# EAGLE schematic hbridge (EAGLE 7.5.0)
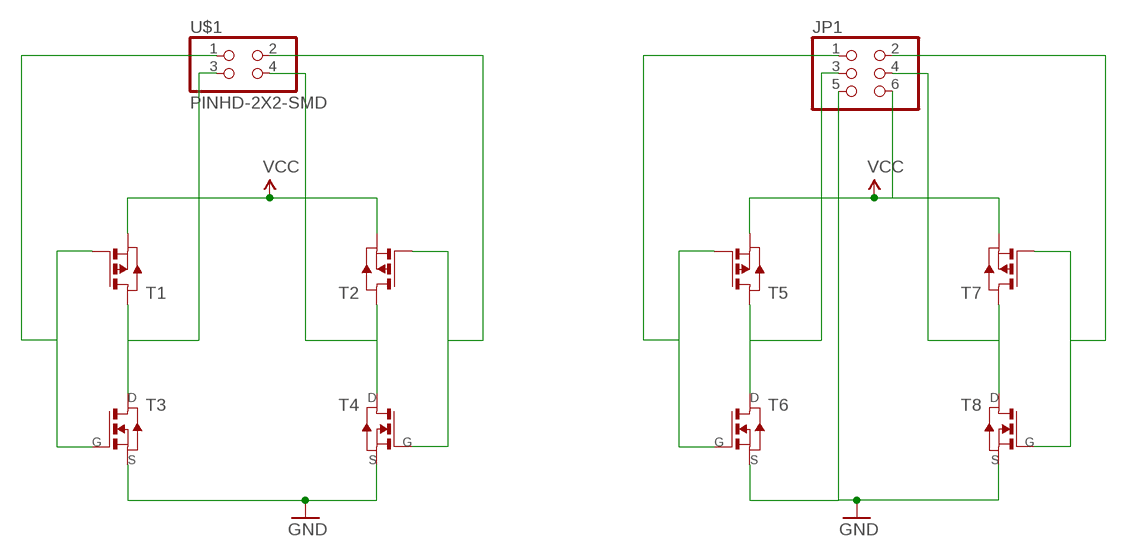
[diagram p0: schematic, sheet 1]

## Parts
JP1  PINHD-2X3-SMD  [2X03SMD]
T1  PMOSFETSOT23  [SOT-23]
T2  PMOSFETSOT23  [SOT-23]
T3  NMOSFETSOT23  [SOT-23]
T4  NMOSFETSOT23  [SOT-23]
T5  PMOSFETSOT23  [SOT-23]
T6  NMOSFETSOT23  [SOT-23]
T7  PMOSFETSOT23  [SOT-23]
T8  NMOSFETSOT23  [SOT-23]
U$1  PINHD-2X2-SMD  [2X02SMD]

## Nets
GND: JP1.5 T3.2(S) T4.2(S) T6.2(S) T8.2(S)
N$1: T1.1(D) T3.1(D) U$1.3
N$2: T2.1(D) T4.1(D) U$1.4
N$3: T2.3(G) T4.3(G) U$1.2
N$4: T1.3(G) T3.3(G) U$1.1
N$5: JP1.3 T5.1(D) T6.1(D)
N$6: JP1.4 T7.1(D) T8.1(D)
N$7: JP1.2 T7.3(G) T8.3(G)
N$8: JP1.1 T5.3(G) T6.3(G)
VCC: JP1.6 T1.2(S) T2.2(S) T5.2(S) T7.2(S)

## Library data of the parts
JP1 = fab:PINHD-2X3-SMD: PIN HEADER
T1 T2 T5 T7 = fab:PMOSFET: MOS FET
T3 T4 T6 T8 = fab:NMOSFET: MOS FET
U$1 = fab:PINHD-2X2-SMD